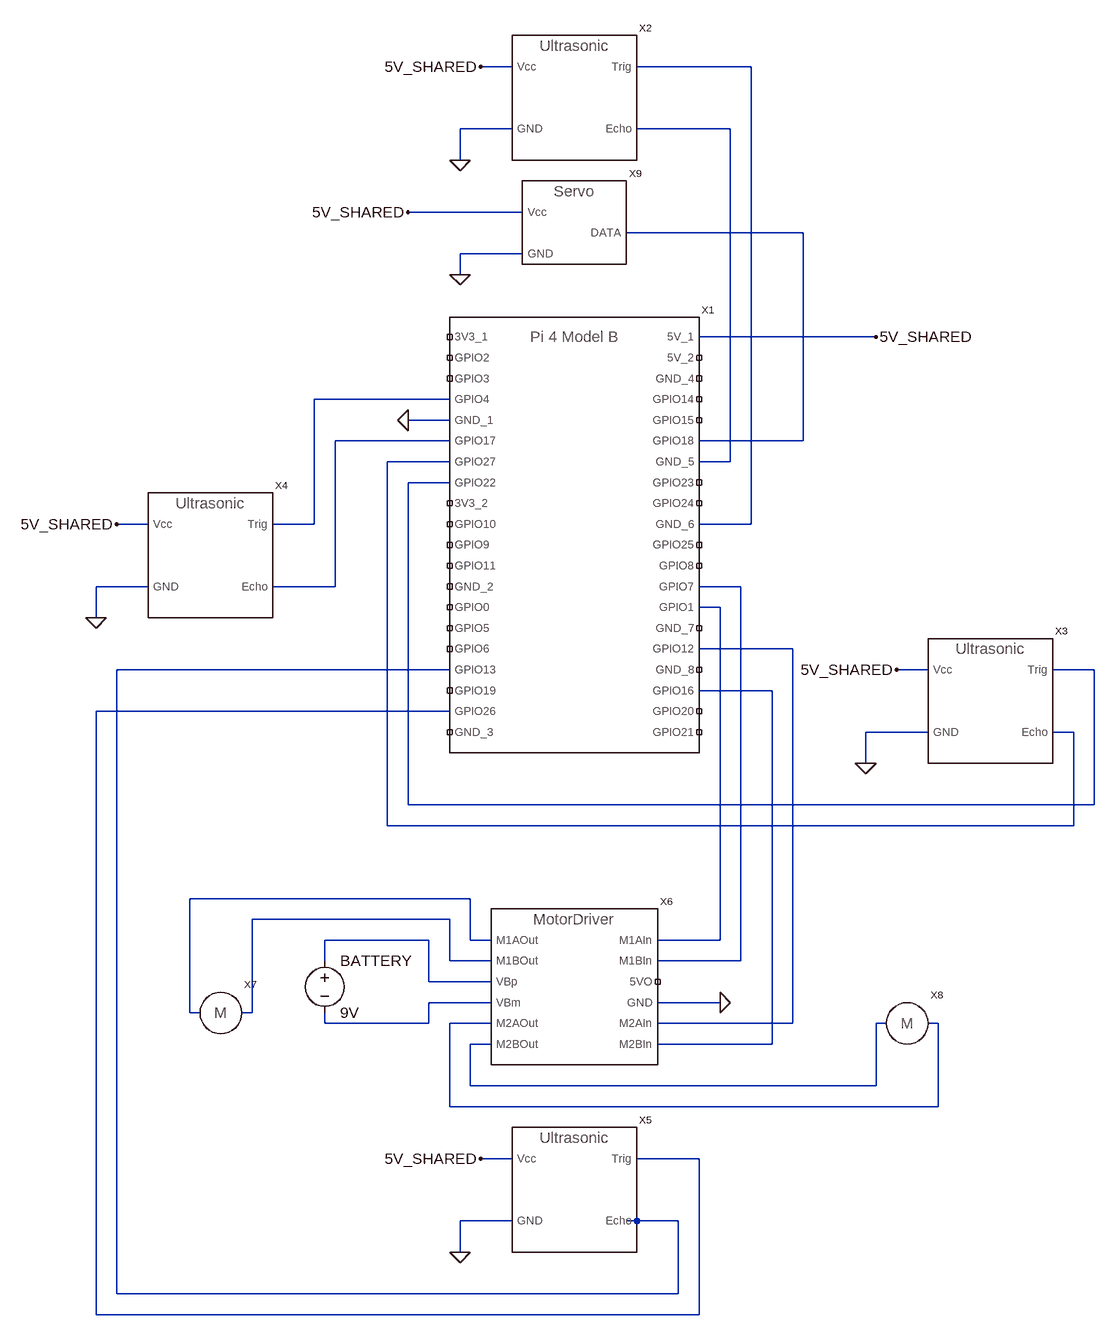
[diagram p0: schematic Draft2.asc]
Draft2.asc, the LTspice schematic file:
Version 4.1
SHEET 1 1064 1252
WIRE 128 -672 80 -672
WIRE 496 -672 320 -672
WIRE 128 -576 48 -576
WIRE 464 -576 320 -576
WIRE 48 -528 48 -576
WIRE 144 -448 -32 -448
WIRE 576 -416 304 -416
WIRE 144 -384 48 -384
WIRE 48 -352 48 -384
WIRE 688 -256 416 -256
WIRE 32 -160 -176 -160
WIRE 32 -128 -32 -128
WIRE 32 -96 -144 -96
WIRE 576 -96 576 -416
WIRE 576 -96 416 -96
WIRE 32 -64 -64 -64
WIRE 464 -64 464 -576
WIRE 464 -64 416 -64
WIRE 32 -32 -32 -32
WIRE -432 32 -480 32
WIRE -176 32 -176 -160
WIRE -176 32 -240 32
WIRE 496 32 496 -672
WIRE 496 32 416 32
WIRE -432 128 -512 128
WIRE -144 128 -144 -96
WIRE -144 128 -240 128
WIRE 480 128 416 128
WIRE 448 160 416 160
WIRE -512 176 -512 128
WIRE 560 224 416 224
WIRE 32 256 -480 256
WIRE 768 256 720 256
WIRE 1024 256 960 256
WIRE 528 288 416 288
WIRE 32 320 -512 320
WIRE 768 352 672 352
WIRE 992 352 960 352
WIRE 672 400 672 352
WIRE -32 464 -32 -32
WIRE 1024 464 1024 256
WIRE 1024 464 -32 464
WIRE -64 496 -64 -64
WIRE 992 496 992 352
WIRE 992 496 -64 496
WIRE 64 608 -368 608
WIRE 32 640 -272 640
WIRE 0 672 -160 672
WIRE 64 672 64 608
WIRE 96 672 64 672
WIRE 448 672 448 160
WIRE 448 672 352 672
WIRE -160 704 -160 672
WIRE 32 704 32 640
WIRE 96 704 32 704
WIRE 480 704 480 128
WIRE 480 704 352 704
WIRE 0 736 0 672
WIRE 96 736 0 736
WIRE 96 768 0 768
WIRE 448 768 352 768
WIRE -368 784 -368 608
WIRE -352 784 -368 784
WIRE -272 784 -272 640
WIRE -272 784 -288 784
WIRE -160 800 -160 784
WIRE 0 800 0 768
WIRE 0 800 -160 800
WIRE 96 800 32 800
WIRE 560 800 560 224
WIRE 560 800 352 800
WIRE 704 800 688 800
WIRE 784 800 768 800
WIRE 96 832 64 832
WIRE 528 832 528 288
WIRE 528 832 352 832
WIRE 64 896 64 832
WIRE 688 896 688 800
WIRE 688 896 64 896
WIRE 32 928 32 800
WIRE 784 928 784 800
WIRE 784 928 32 928
WIRE 128 1008 80 1008
WIRE 416 1008 320 1008
WIRE 128 1104 48 1104
WIRE 320 1104 304 1104
WIRE 384 1104 320 1104
WIRE 48 1152 48 1104
WIRE -480 1216 -480 256
WIRE 384 1216 384 1104
WIRE 384 1216 -480 1216
WIRE -512 1248 -512 320
WIRE 416 1248 416 1008
WIRE 416 1248 -512 1248
FLAG 448 768 0
FLAG -512 176 0
FLAG 672 400 0
FLAG 48 1152 0
FLAG 48 -528 0
FLAG -32 -128 0
FLAG 48 -352 0
FLAG -32 -448 5V_SHARED
FLAG 688 -256 5V_SHARED
FLAG 80 -672 5V_SHARED
FLAG -480 32 5V_SHARED
FLAG 720 256 5V_SHARED
FLAG 80 1008 5V_SHARED
SYMBOL Rpi4B 224 48 R0
SYMATTR InstName X1
SYMBOL Ultrasonic 224 -624 R0
SYMATTR InstName X2
SYMBOL Ultrasonic 864 304 R0
SYMATTR InstName X3
SYMBOL Ultrasonic -336 80 R0
SYMATTR InstName X4
SYMBOL Ultrasonic 224 1056 R0
SYMATTR InstName X5
SYMBOL MotorDriver 224 752 R0
SYMATTR InstName X6
SYMBOL Motor -320 784 R0
SYMATTR InstName X7
SYMBOL Motor 736 800 R0
SYMATTR InstName X8
SYMBOL voltage -160 688 R0
SYMATTR InstName BATTERY
SYMATTR Value 9V
SYMBOL Servo 224 -416 R0
SYMATTR InstName X9

The netlist it stands for:
* Draft2.asc
X§X1 NC_01 NC_02 NC_03 NC_04 NC_05 NC_06 NC_07 NC_08 NC_09 NC_10 NC_11 N004 0 N005 N006 N007 N011 NC_12 N013 NC_13 NC_14 NC_15 NC_16 NC_17 N003 N002 NC_18 NC_19 5V_SHARED N001 NC_20 NC_21 N008 N009 NC_22 N010 NC_23 N012 NC_24 NC_25 Rpi4B  ; pins 3V3_2 GPIO10 GPIO9 GPIO11 GND_2 GPIO0 GPIO5 GPIO6 3V3_1 GPIO2 GPIO3 GPIO4 GND_1 GPIO17 GPIO27 GPIO22 GPIO13 GPIO19 GPIO26 GND_3 5V_2 GND_4 GPIO14 GPIO15 GPIO18 GND_5 GPIO23 GPIO24 5V_1 GND_6 GPIO25 GPIO8 GPIO7 GPIO1 GND_7 GPIO12 GND_8 GPIO16 GPIO20 GPIO21
X§X2 5V_SHARED N001 0 N002 Ultrasonic  ; pins Vcc Trig GND Echo
X§X3 5V_SHARED N007 0 N006 Ultrasonic  ; pins Vcc Trig GND Echo
X§X4 5V_SHARED N004 0 N005 Ultrasonic  ; pins Vcc Trig GND Echo
X§X5 5V_SHARED N013 0 N011 Ultrasonic  ; pins Vcc Trig GND Echo
X§X6 N014 N015 N018 N019 N016 N017 N009 N008 N010 N012 NC_26 0 MotorDriver  ; pins M1AOut M1BOut M2AOut M2BOut VBp VBm M1AIn M1BIn M2AIn M2BIn 5VO GND
X§X7 N014 N015 Motor
X§X8 N019 N018 Motor
V§BATTERY N016 N017 9V
X§X9 5V_SHARED N003 0 Servo  ; pins Vcc DATA GND
.backanno
.end